# EAGLE schematic UniversalBoardBreakout (EAGLE 8.5.1)
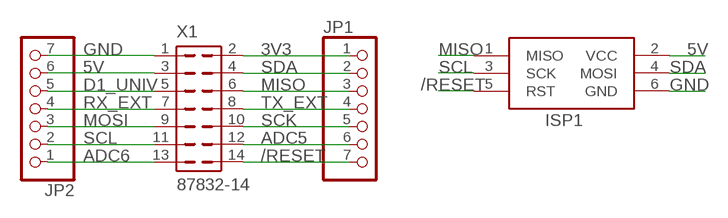
[diagram p0: schematic, sheet 1]

## Parts
ISP1  AVRISP-6  [AVRISP]
JP1  CONN_7  [1X07]
JP2  CONN_7  [1X07]
X1  87832-14  [87832-14]

## Nets
3V3: JP1.1 X1.2
5V: ISP1.2(VCC) JP2.6 X1.3
/RESET: ISP1.5(RST) JP1.7 X1.14
ADC5: JP1.6 X1.12
ADC6: JP2.1 X1.13
D1_UNIV: JP2.5 X1.5
GND: ISP1.6(GND) JP2.7 X1.1
MISO: ISP1.1(MISO) JP1.3 X1.6
MOSI: JP2.3 X1.9
RX_EXT: JP2.4 X1.7
SCK: JP1.5 X1.10
SCL: ISP1.3(SCK) JP2.2 X1.11
SDA: ISP1.4(MOSI) JP1.2 X1.4
TX_EXT: JP1.4 X1.8

## Library data of the parts
ISP1 = bschulz:AVRISP: AVR ISP HEADER Standard 6 pin header for AVR programming
JP1 JP2 = bschulz:CONN_7: PIN HEADER
X1 = bschulz:87832-14: Milli-Grid Header 2.00mm (.079") Pitch; MF: MOLEX; OC_FARNELL: 7434698; OC_NEWARK: unknown